# EAGLE design DualBalancedOutput (EAGLE 7.5.0)
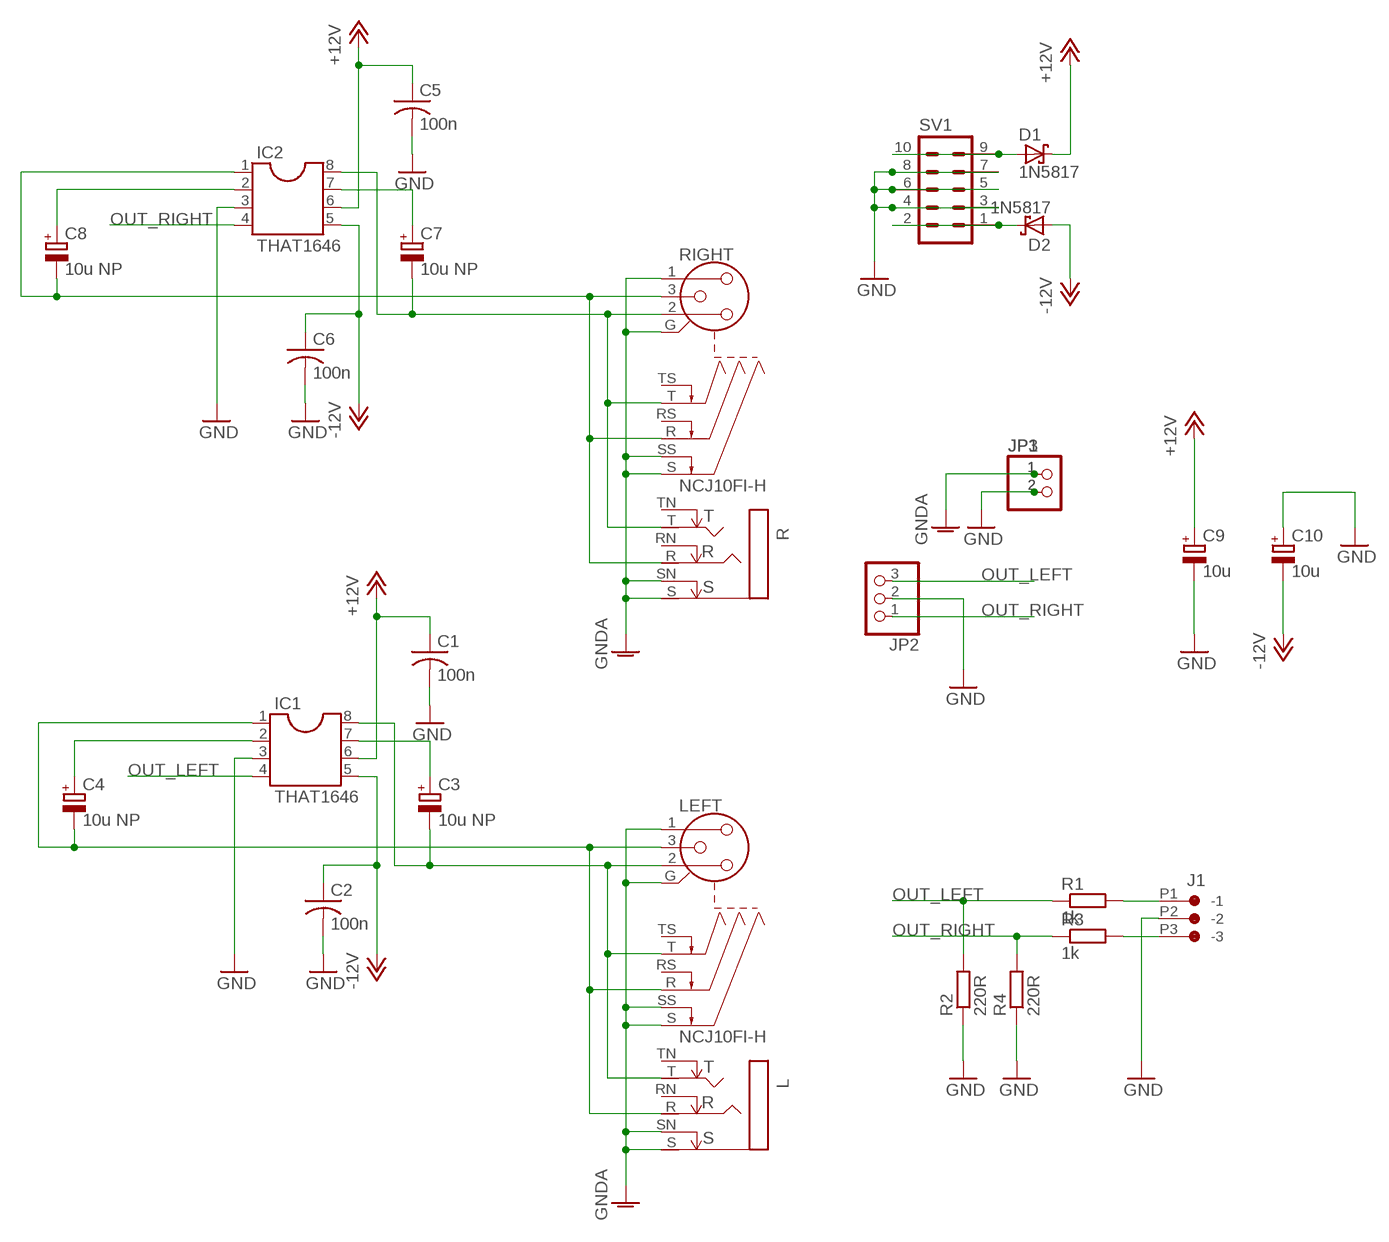
[diagram p0: schematic, sheet 1]

## Parts
C1  100n  C-US050-024X044  [C050-024X044]
C2  100n  C-US050-024X044  [C050-024X044]
C3  10u NP  CPOL-EUE2-5  [E2-5]
C4  10u NP  CPOL-EUE2-5  [E2-5]
C5  100n  C-US050-024X044  [C050-024X044]
C6  100n  C-US050-024X044  [C050-024X044]
C7  10u NP  CPOL-EUE2-5  [E2-5]
C8  10u NP  CPOL-EUE2-5  [E2-5]
C9  10u  CPOL-EUE5-6  [E5-6]
C10  10u  CPOL-EUE5-6  [E5-6]
D1  1N5817  1N5819-B  [DO41-7.6]
D2  1N5817  1N5819-B  [DO41-7.6]
IC1  THAT1646  DIL8  [DIL08]
IC2  THAT1646  DIL8  [DIL08]
J1  CON-JST_PH_3W  [CON-JST_PH_3W]
JP1  PINHD-1X2  [1X02]
JP2  PINHD-1X3  [1X03]
JP3  PINHD-1X2  [1X02]
L  NEUTRIK_NMJ6HCD2  [NMJ6HCD2]
LEFT  NCJ10FI-H  [NCJ10FI-H]
R  NEUTRIK_NMJ6HCD2  [NMJ6HCD2]
R1  1k  R-EU_0204/7  [0204/7]
R2  220R  R-EU_0204/7  [0204/7]
R3  1k  R-EU_0204/7  [0204/7]
R4  220R  R-EU_0204/7  [0204/7]
RIGHT  NCJ10FI-H  [NCJ10FI-H]
SV1  MA05-2  [MA05-2]

## Nets
+12V: C1.1 C5.1 C9.+ D1.C IC1.6 IC2.6
-12V: C2.1 C6.1 C10.- D2.A IC1.5 IC2.5
GND: C1.2 C2.2 C5.2 C6.2 C9.- C10.+ IC1.3 IC2.3 J1.P2(-2) JP1.2 JP2.2 JP3.2 R2.1 R4.1 SV1.3 SV1.4 SV1.5 SV1.6 SV1.7 SV1.8
GNDA: JP1.1 JP3.1 L.S L.SN LEFT.1 LEFT.G LEFT.S LEFT.SS R.S R.SN RIGHT.1 RIGHT.G RIGHT.S RIGHT.SS
N$1: C3.- IC1.8 L.T LEFT.2 LEFT.T
N$2: C4.- IC1.1 L.R LEFT.3 LEFT.R
N$3: C3.+ IC1.7
N$4: C4.+ IC1.2
N$5: D2.C SV1.1 SV1.2
N$6: D1.A SV1.9 SV1.10
N$7: J1.P3(-3) R3.2
N$8: C7.+ IC2.7
N$9: J1.P1(-1) R1.2
N$10: C8.+ IC2.2
N$18: C7.- IC2.8 R.T RIGHT.2 RIGHT.T
N$19: C8.- IC2.1 R.R RIGHT.3 RIGHT.R
OUT_LEFT: IC1.4 JP2.3 R1.1 R2.2
OUT_RIGHT: IC2.4 JP2.1 R3.1 R4.2
Unconnected: L.RN L.TN LEFT.RS LEFT.TS R.RN R.TN RIGHT.RS RIGHT.TS

## Library data of the parts
C1 C2 C5 C6 = rcl:C-US: CAPACITOR, American symbol
C3 C4 C7 C8 = Rebel:CPOL-EU: POLARIZED CAPACITOR, European symbol
C9 C10 = rcl:CPOL-EU: POLARIZED CAPACITOR, European symbol
D1 D2 = diode:1N581*: 1.0A SCHOTTKY BARRIER RECTIFIER Source: http://www.diodes.com/datasheets/ds23001.pdf
IC1 IC2 = ic-package:DIL8: Dual In Line / Socket
J1 = Rebel:CON-JST_PH_3W
JP1 JP3 = pinhead:PINHD-1X2: PIN HEADER
JP2 = pinhead:PINHD-1X3: PIN HEADER
L R = neutrik_jacks:NEUTRIK_NMJ6HCD2
LEFT RIGHT = con-neutrik_ag:NCJ10FI-: Neutrik Audio Connector XLR SERIES Stereo 1/4" jack with switch Source: www.neutrik.com/; OC_FARNELL: unknown; OC_NEWARK: unknown
R1-R4 = Rebel:R-EU_: RESISTOR, European symbol
SV1 = con-lstb:MA05-2: PIN HEADER; OC_FARNELL: unknown; OC_NEWARK: unknown

## Board
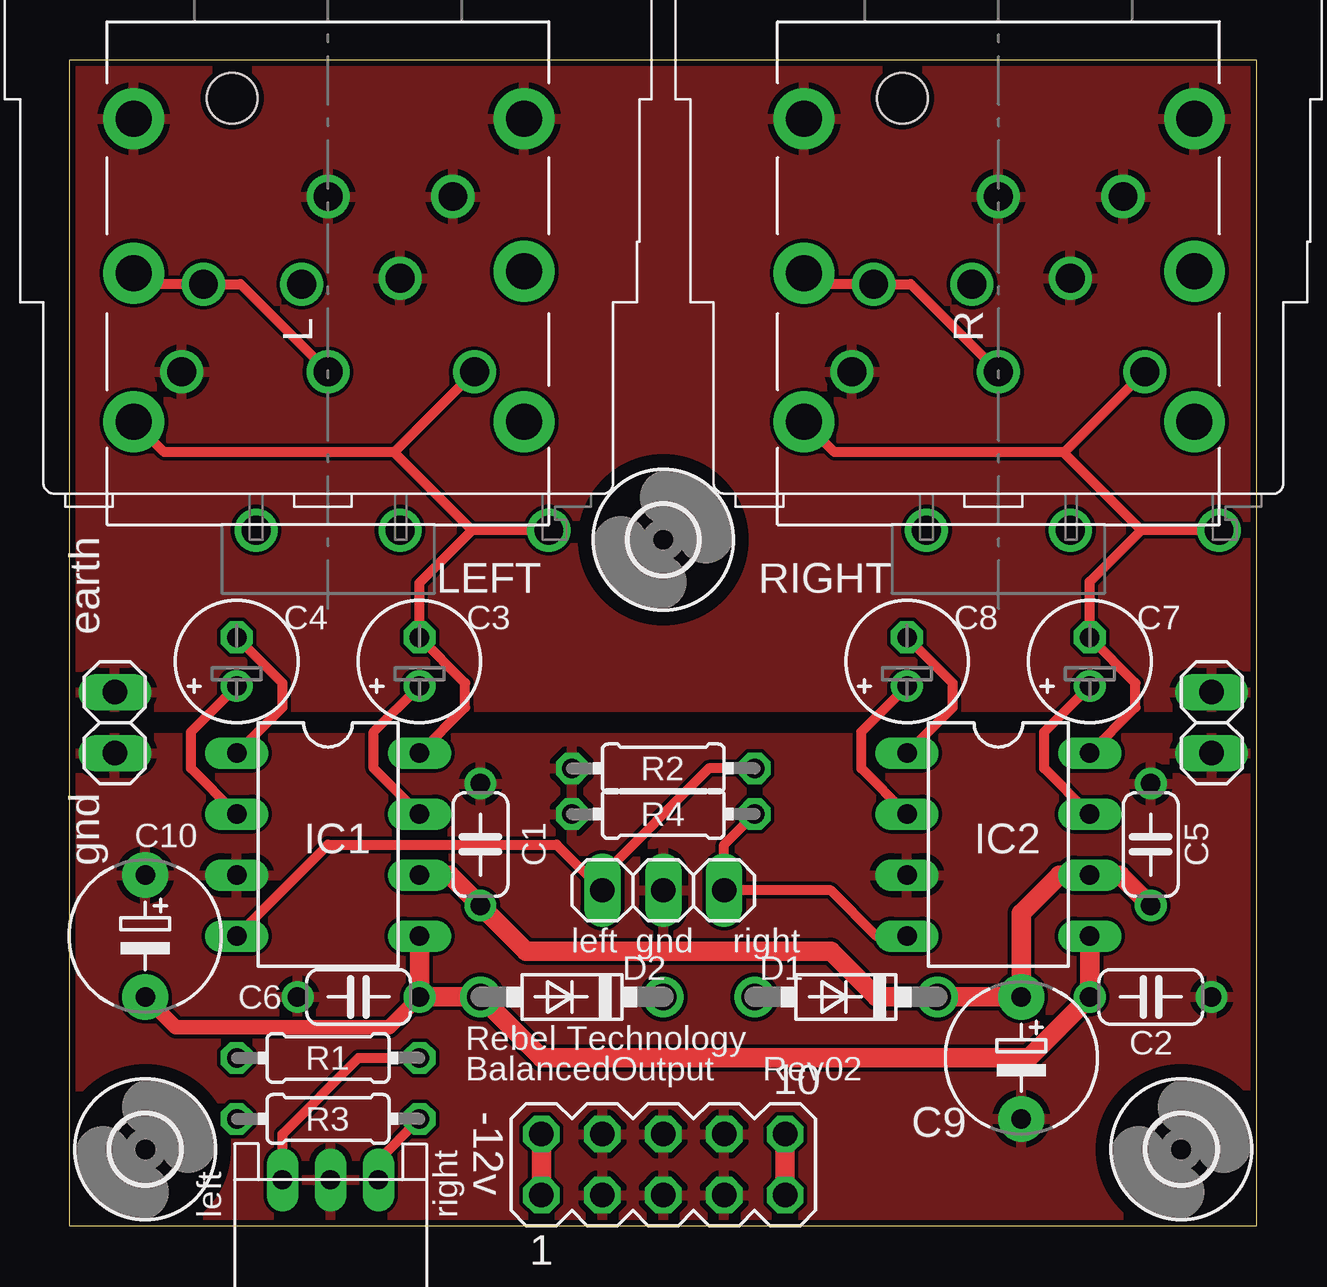
[diagram p1: board, top side]
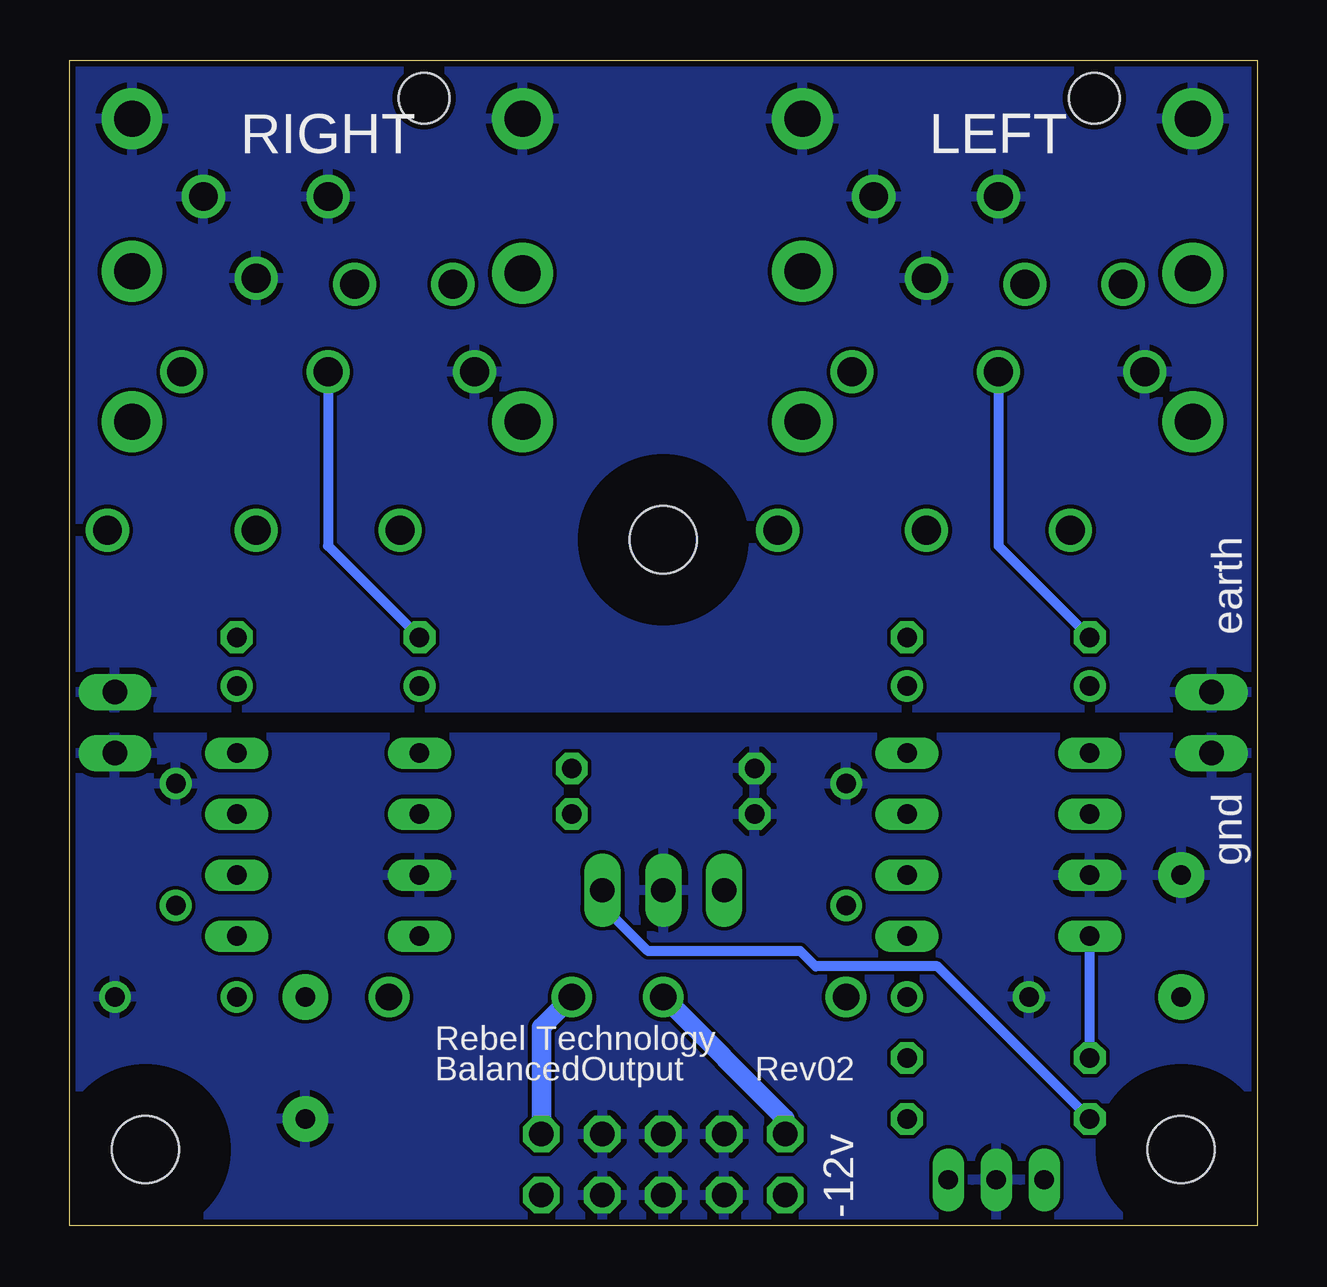
[diagram p2: board, bottom side, seen from below]

Size 49.51 x 48.56 mm. Coordinates in mm from the lower left corner, seen from the top.
Outline: 0,0 49.51,0 49.51,48.56 0,48.56 0,0
Copper layers (1*16): Top 0.035mm / dielectric 1.5mm / Bottom 0.035mm
Design rules "Fusion_eagle_rule_v1.1": minimum track width 6mil, minimum drill 12mil, track to track 6mil, track to pad 6mil, pad to pad 6mil, via to via 6mil, smd to smd 0mil, copper to edge 10mil, drill to drill 10mil, minimum pad ring 10mil, minimum via ring 6mil, stop-mask expansion 2mil, vias tented up to drill 100mil, thermal gap 10mil

### Footprints (pad centres in the part's own frame; a part is rotated, then mirrored left to right if it is on the bottom)
C050-024X044 = drill 0.813: 1 -2.54,0; 2 2.54,0
E2-5 = drill 0.813 pad 1.27: + -1.016,0 | drill 0.813 pad 1.27 octagon: - 1.016,0
E5-6 = drill 0.813 pad 1.905: + -2.54,0; - 2.54,0
DO41-7.6 = drill 1.1 pad 1.7: A 3.81,0; C -3.81,0
DIL08 = drill 0.813 long: 1 -3.81,-3.81; 2 -1.27,-3.81; 3 1.27,-3.81; 4 3.81,-3.81; 5 3.81,3.81; 6 1.27,3.81; 7 -1.27,3.81; 8 -3.81,3.81
CON-JST_PH_3W = drill 0.8 long: P1 0,0; P2 -2,0; P3 -4,0
1X02 = drill 1.016 long: 1 -1.27,0; 2 1.27,0
1X03 = drill 1.016 long: 1 -2.54,0; 2 0,0; 3 2.54,0
NMJ6HCD2 = drill 1.5 pad 2.54: R -0.318,8.096; RN -0.238,-8.176; S 6.112,8.096; SN 6.112,-8.176; T -6.509,8.096; TN -6.509,-8.176
NCJ10FI-H = drill 1.2: 1 -6.1,-18.4; 2 6.1,-18.4; 3 0,-18.4; G 0,-11.1; GN -1.1,-14.75; R -5.2,-14.75; RS -3,-25; S 5.2,-11.1; SS 3,-14.5; T 9.2,-25; TS 3,-25 | hole 2.1: -4,-7
0204/7 = drill 0.813 octagon: 1 -3.81,0; 2 3.81,0
MA05-2 = drill 1.016 octagon: 1 -5.08,-1.27; 2 -5.08,1.27; 3 -2.54,-1.27; 4 -2.54,1.27; 5 0,-1.27; 6 0,1.27; 7 2.54,-1.27; 8 2.54,1.27; 9 5.08,-1.27; 10 5.08,1.27
2,8 = hole 2.8: 0,0

### Placement (x,y rotation side)
C1  17.14,15.88 90 top
C2  45.09,9.53 0 top
C3  14.61,23.5 90 top
C4  6.99,23.5 90 top
C5  45.09,15.88 90 top
C6  12.06,9.53 180 top
C7  42.55,23.5 90 top
C8  34.92,23.5 90 top
C9  39.69,6.99 270 top
C10  3.17,12.06 270 top
D1  32.38,9.53 180 top
D2  20.95,9.53 180 top
IC1  10.79,15.88 270 top
IC2  38.73,15.88 270 top
J1  8.89,1.91 180 top
JP1  1.91,20.95 270 top
JP2  24.77,13.97 180 top
JP3  47.62,20.95 270 top
L  10.79,40.01 90 top
LEFT  10.79,53.98 0 top
R  38.73,40.01 90 top
R1  10.79,6.99 0 top
R2  24.77,19.05 0 top
R3  10.79,4.45 0 top
R4  24.77,17.14 0 top
RIGHT  38.73,53.98 0 top
SV1  24.77,2.54 0 top
U$1  [2,8]  3.17,3.17 0 top
U$2  [2,8]  46.35,3.17 0 top
U$3  [2,8]  24.77,28.57 0 top

### Tracks (layer width: path | path; a pad name or v marks a point on that pad's centre or on a via)
+12V
  Top 0.813: IC1.6 15.88,14.61 C1.1 19.05,11.43 31.75,11.43 33.66,9.53 D1.C C9.+ 39.69,13.02 41.27,14.61 IC2.6 43.81,14.61 C5.1
-12V
  Top 0.61: C10.- 4.45,8.26 13.34,8.26 C6.1
  Top 0.813: IC2.5 C2.1 40.01,6.99 19.68,6.99 D2.A C6.1 IC1.5
GND
  pour Bottom: -4.45,20.32 59.05,20.32 59.05,-3.17 -4.45,-3.17
  pour Top: -5.71,20.32 57.78,20.32 57.78,-3.17 -5.71,-3.17
GNDA
  pour Bottom: -4.45,21.59 -4.45,51.44 59.05,51.44 59.05,21.59
  pour Top: -5.71,21.59 -5.71,51.44 57.78,51.44 57.78,21.59
N$1
  Top 0.406: 13.55,32.23 LEFT.2 | LEFT.T 16.8,28.98 | 16.8,28.98 13.55,32.23 | IC1.8 16.51,21.59 16.51,22.61 C3.- 14.61,26.78 16.8,28.98 | 13.55,32.23 3.97,32.23 L.T
N$2
  Top 0.406: L.R 3.19,39.23 LEFT.R 7.14,39.23 LEFT.3 | IC1.1 8.89,21.59 8.89,22.61 C4.-
  Bottom 0.406: LEFT.3 10.79,28.32 C4.-
N$3
  Top 0.406: IC1.7 12.7,19.05 12.7,20.57 C3.+
N$4
  Top 0.406: IC1.2 5.08,19.05 5.08,20.57 C4.+
N$5
  Top 0.813: SV1.1 SV1.2
  Bottom 0.813: SV1.2 19.68,4.45 D2.C
N$6
  Top 0.813: SV1.9 SV1.10
  Bottom 0.813: SV1.10 29.84,8.26 D1.A
N$7
  Top 0.406: J1.P3 12.89,2.73 R3.2
N$8
  Top 0.406: IC2.7 40.64,19.05 40.64,20.57 C7.+
N$9
  Top 0.406: J1.P1 8.89,3.81 12.06,6.99 R1.2
N$10
  Top 0.406: IC2.2 33.02,19.05 33.02,20.57 C8.+
N$18
  Top 0.406: 41.49,32.23 RIGHT.2 | 41.49,32.23 41.49,32.17 44.69,28.98 | RIGHT.T 44.69,28.98 | IC2.8 44.45,21.59 44.45,22.61 C7.- 42.55,26.84 44.69,28.98 | 41.49,32.23 31.91,32.23 R.T
N$19
  Top 0.406: R.R 31.13,39.23 RIGHT.R 35.09,39.23 RIGHT.3 | IC2.1 36.83,21.59 36.83,22.61 C8.-
  Bottom 0.406: RIGHT.3 38.73,28.32 C8.-
OUT_LEFT
  Top 0.406: IC1.4 10.79,15.88 20.32,15.88 JP2.3 22.23,14.61 26.67,19.05 R2.2
  Bottom 0.406: R1.1 IC1.4
OUT_RIGHT
  Top 0.406: R4.2 27.3,15.88 JP2.1 31.75,13.97 33.66,12.06 IC2.4
  Bottom 0.406: R3.1 13.34,10.79 18.41,10.79 19.05,11.43 25.4,11.43 27.3,13.34 JP2.1

### Text on the board
tPlace: earth | gnd | left | gnd | right | Rebel Technology | BalancedOutput | Rev02 | -12v | left | right
bPlace: LEFT | RIGHT | earth | gnd | Rebel Technology | Rev02 | BalancedOutput | -12v